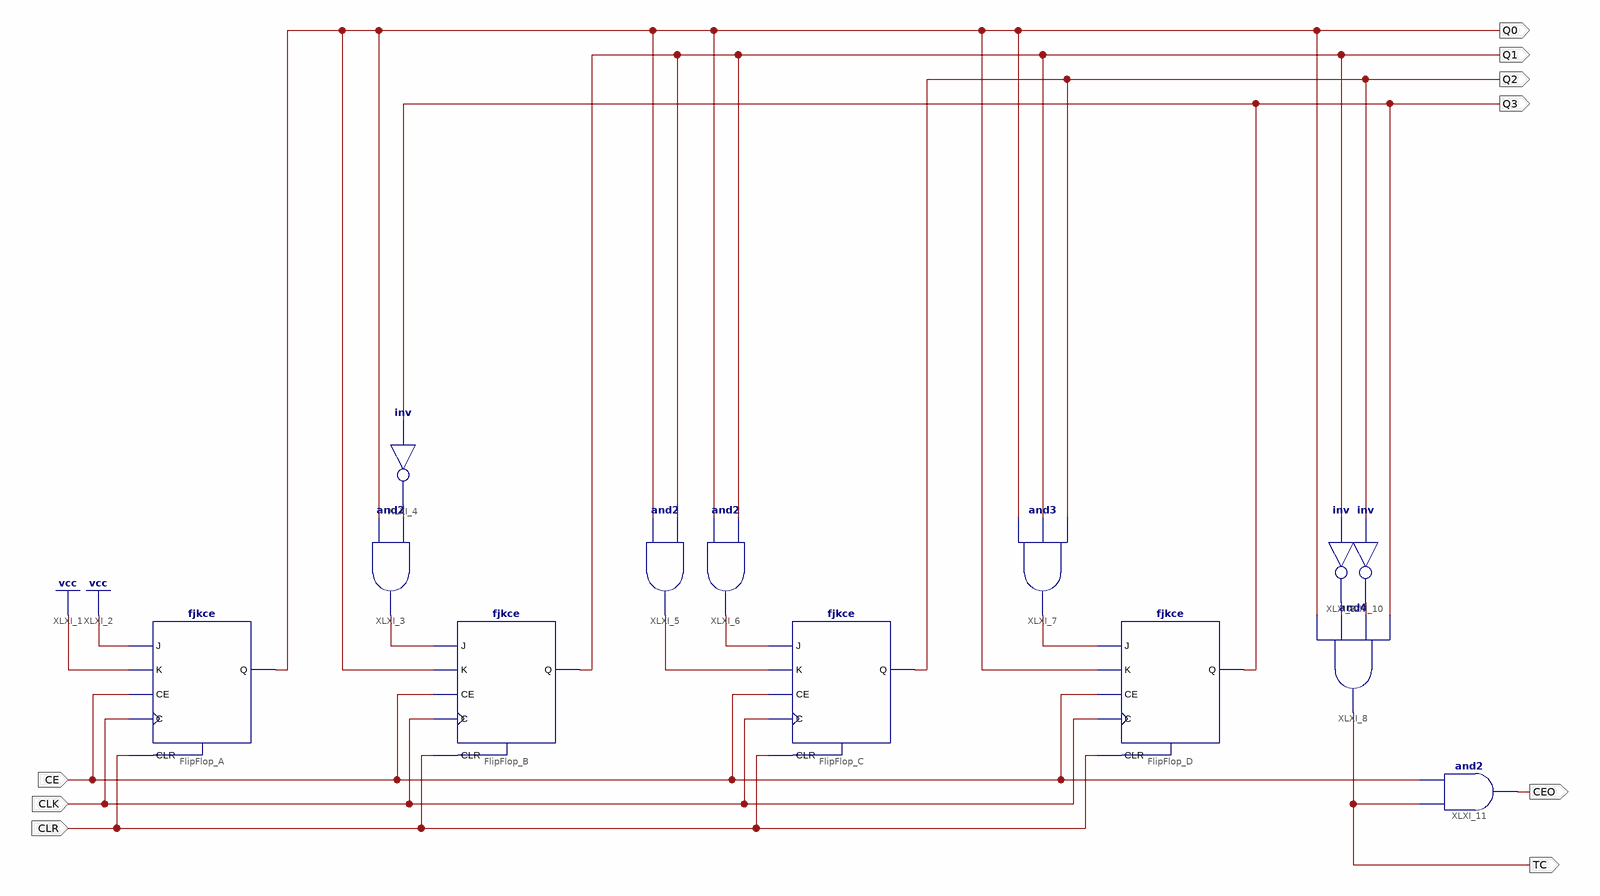
[diagram p0: schematic sheet 1]
// Xilinx ISE schematic Counter0_9.sch (spartan6) as structural Verilog: 13 symbols, 9 ports
module Counter0_9 (
  input  CE,
  input  CLK,
  input  CLR,
  output CEO,
  output TC,
  output Q0,
  output Q1,
  output Q2,
  output Q3
);

  wire XLXN_3, XLXN_4, XLXN_5, XLXN_6, XLXN_7, XLXN_8, XLXN_9;

  fjkce FlipFlop_A (.C(CLK), .CE(CE), .CLR(CLR), .J(1'b1), .K(1'b1), .Q(Q0));
  and XLXI_3 (XLXN_3, Q0, XLXN_4);
  not XLXI_4 (XLXN_4, Q3);
  fjkce FlipFlop_B (.C(CLK), .CE(CE), .CLR(CLR), .J(XLXN_3), .K(Q0), .Q(Q1));
  and XLXI_5 (XLXN_5, Q0, Q1);
  and XLXI_6 (XLXN_6, Q0, Q1);
  fjkce FlipFlop_C (.C(CLK), .CE(CE), .CLR(CLR), .J(XLXN_6), .K(XLXN_5), .Q(Q2));
  and XLXI_7 (XLXN_7, Q0, Q1, Q2);
  fjkce FlipFlop_D (.C(CLK), .CE(CE), .CLR(CLR), .J(XLXN_7), .K(Q0), .Q(Q3));
  and XLXI_8 (TC, Q0, XLXN_8, XLXN_9, Q3);
  not XLXI_9 (XLXN_8, Q1);
  not XLXI_10 (XLXN_9, Q2);
  and XLXI_11 (CEO, TC, CE);
endmodule
